# Altium project tajetaBaseV2.PrjPcb
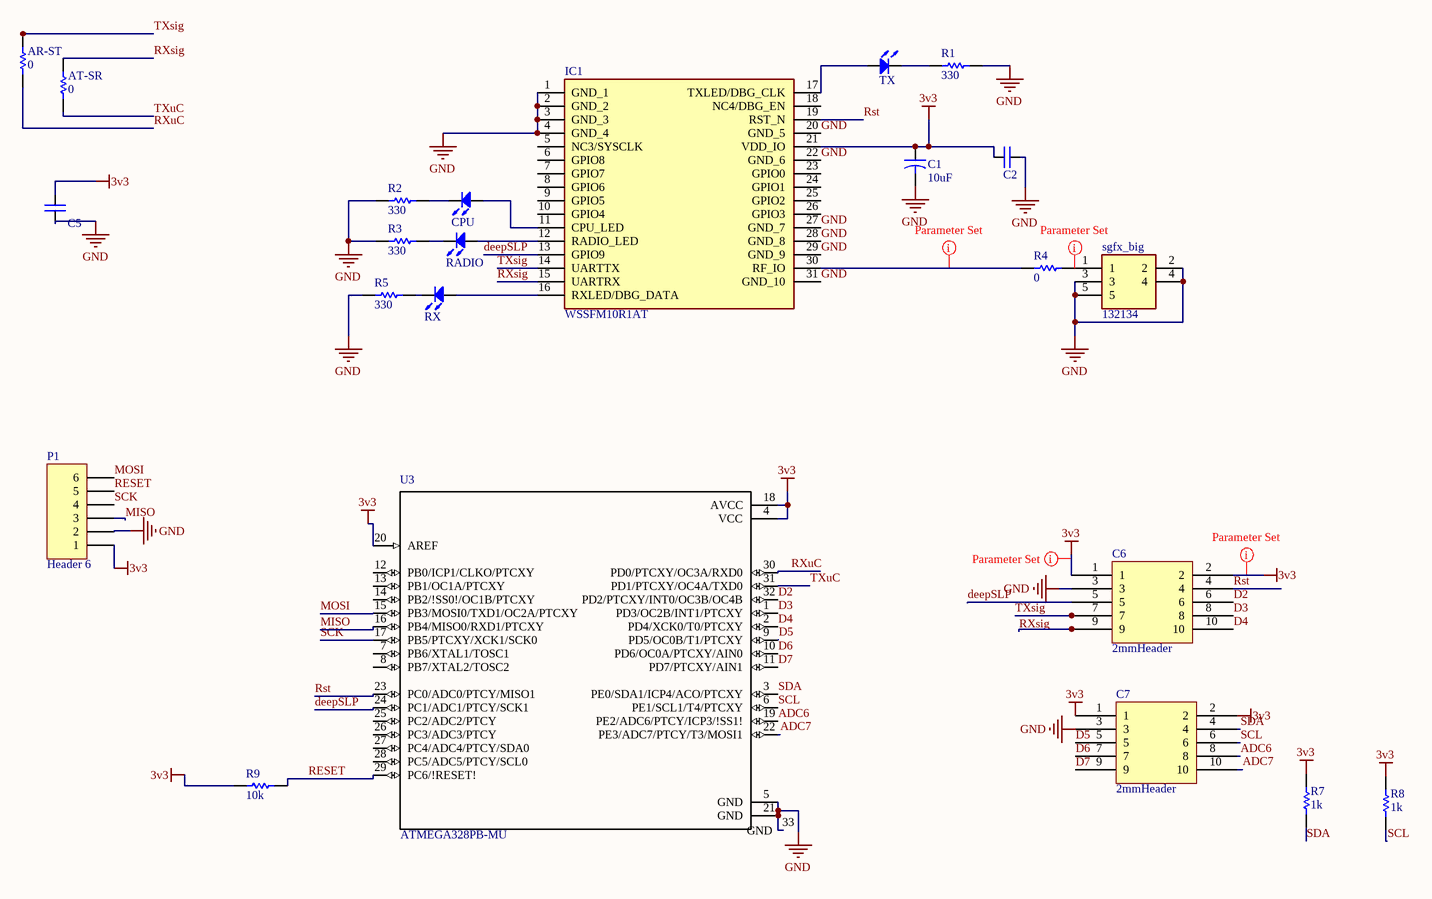
[diagram p0: mainV2.SchDoc]
1 sheet, 23 parts. Net scope: global (net labels, ports and power ports of the same name join across sheets).
Board file: mainPCBV2.PcbDoc

## Sheet mainV2.SchDoc
size A3; SheetNumber: 1; SheetTotal: 1

### Parts
AR-ST  value 0  [RES_SMD_0402]  (hidden comment: Res)
AT-SR  value 0  [RES_SMD_0402]  (hidden comment: Res)
C1  value 10uF  [Capacitor E SMT]  (hidden comment: Cap)
C2  CAP_SMT_0603  [SMT_CAP_0603]  (value not drawn)
C5  CAP_SMT_0603  [SMT_CAP_0603]  (value not drawn)
C6  2mmHeader  [2mmHeader5x2]
C7  2mmHeader  [2mmHeader5x2]
CPU  LED  [Led0805]  (value not drawn)
IC1  WSSFM10R1AT  [WSSFM10R1AT]
P1  Header 6  [HDR1X6]
R1  value 330  [RES_SMD_0402]  (hidden comment: Res)
R2  value 330  [RES_SMD_0402]  (hidden comment: Res)
R3  value 330  [RES_SMD_0402]  (hidden comment: Res)
R4  value 0  [RES_SMD_0402]  (hidden comment: Res)
R5  value 330  [RES_SMD_0402]  (hidden comment: Res)
R7  value 1k  [SMT_CAP_0603]  (hidden comment: Res)
R8  value 1k  [SMT_CAP_0603]  (hidden comment: Res)
R9  value 10k  [RES_SMD_0402]  (hidden comment: Res)
RADIO  LED  [Led0805]  (value not drawn)
RX  LED  [Led0805]  (value not drawn)
sgfx_big  132134  [132134]
TX  LED  [Led0805]  (value not drawn)
U3  ATMEGA328PB-MU  [ATMEGA328TQFP]

### Nets
3v3: C1.2 C2.1 C5.1 C6.1 C6.2 C7.1 C7.2 IC1.21(VDD_IO) P1.1 R7.1 R8.1 R9.1 U3.4(VCC) U3.18(AVCC) U3.20(AREF)
GND: C1.1 C2.2 C5.2 C6.3 C7.3 IC1.1(GND_1) IC1.2(GND_2) IC1.3(GND_3) IC1.4(GND_4) IC1.20(GND_5) IC1.22(GND_6) IC1.27(GND_7) IC1.28(GND_8) IC1.29(GND_9) IC1.31(GND_10) P1.2 R1.2 R2.1 R3.1 R5.1 sgfx_big.2 sgfx_big.3 sgfx_big.4 sgfx_big.5 U3.5(GND) U3.21(GND) U3.33(GND)
ADC6: C7.8 U3.19(PE2/ADC6/PTCY/ICP3/!SS1!)
ADC7: C7.10 U3.22(PE3/ADC7/PTCY/T3/MOSI1)
D2: C6.6 U3.32(PD2/PTCXY/INT0/OC3B/OC4B)
D3: C6.8 U3.1(PD3/OC2B/INT1/PTCXY)
D4: C6.10 U3.2(PD4/XCK0/T0/PTCXY)
D5: C7.5 U3.9(PD5/OC0B/T1/PTCXY)
D6: C7.7 U3.10(PD6/OC0A/PTCXY/AIN0)
D7: C7.9 U3.11(PD7/PTCXY/AIN1)
deepSLP: C6.5 IC1.13(GPIO9) U3.24(PC1/ADC1/PTCY/SCK1)
MISO: P1.3 U3.16(PB4/MISO0/RXD1/PTCXY)
MOSI: P1.6 U3.15(PB3/MOSI0/TXD1/OC2A/PTCXY)
RESET: P1.5 R9.2 U3.29(PC6/!RESET!)
Rst: C6.4 IC1.19(RST_N) U3.23(PC0/ADC0/PTCY/MISO1)
RXsig: AT-SR.1 C6.9 IC1.15(UARTRX)
RXuC: AR-ST.2 U3.30(PD0/PTCXY/OC3A/RXD0)
SCK: P1.4 U3.17(PB5/PTCXY/XCK1/SCK0)
SCL: C7.6 R8.2 U3.6(PE1/SCL1/T4/PTCXY)
SDA: C7.4 R7.2 U3.3(PE0/SDA1/ICP4/ACO/PTCXY)
TXsig: AR-ST.1 C6.7 IC1.14(UARTTX)
TXuC: AT-SR.2 U3.31(PD1/PTCXY/OC4A/TXD0)
NetCPU_1: CPU.1(A) IC1.11(CPU_LED)
NetCPU_2: CPU.2(K) R2.2
NetIC1_12: IC1.12(RADIO_LED) RADIO.1(A)
NetIC1_16: IC1.16(RXLED/DBG_DATA) RX.1(A)
NetIC1_17: IC1.17(TXLED/DBG_CLK) TX.1(A)
NetIC1_30: IC1.30(RF_IO) R4.1
NetR1_1: R1.1 TX.2(K)
NetR3_2: R3.2 RADIO.2(K)
NetR4_2: R4.2 sgfx_big.1
NetR5_2: R5.2 RX.2(K)

Not connected (* = marked no-connect by the designer): IC1 5(NC3/SYSCLK) 6(GPIO8) 7(GPIO7) 8(GPIO6) 9(GPIO5) 10(GPIO4) 18(NC4/DBG_EN) 23(GPIO0) 24(GPIO1) 25(GPIO2) 26(GPIO3); U3 7(PB6/XTAL1/TOSC1) 8(PB7/XTAL2/TOSC2) 12(PB0/ICP1/CLKO/PTCXY) 13(PB1/OC1A/PTCXY) 14(PB2/!SS0!/OC1B/PTCXY) 25(PC2/ADC2/PTCY) 26(PC3/ADC3/PTCY) 27(PC4/ADC4/PTCY/SDA0) 28(PC5/ADC5/PTCY/SCL0)

### Layout directives
net class Antena: NetIC1_30, NetR4_2
net class power: 3v3

### Library data of the parts
AR-ST AT-SR R7 R8 = RES_SMD: Resistor; Manufacturer: Generic Components; Class I: Passive; Published: 8-Jun-2000; Revision: July-2002: Re-released for DXP Platform.; Publisher: Altium Limited; Class II: Resistor
C1 = Cap E SMT: Capacitor Electrolitico; Manufacturer: Generic Components; Class I: Passive; Published: 23-Sep-2002; Publisher: Altium Limited; Class II: Capacitor
CPU RADIO RX TX = LED: Manufacturer: Generic Components; Class I: Optoelectronic; Published: 8-Jun-2000; Revision: July-2002: Re-released for DXP Platform.; Publisher: Altium Limited; Class II: LED
IC1 = WSSFM10R1AT: Integrated Circuit; Manufacturer_Name: Wisol; Datasheet Link: http://www.erikrasmussen.dk/wisol_wssfm10r1at.pdf; Height: 2mm; Manufacturer_Part_Number: WSSFM10R1AT
P1 = Header 6: Header, 6-Pin; LatestRevisionDate: 17-Jul-2002; LatestRevisionNote: Re-released for DXP Platform.; Publisher: Altium Limited
R1-R5 R9 = RES_SMT_1206: Resistor; Manufacturer: Generic Components; Class I: Passive; Published: 8-Jun-2000; Revision: July-2002: Re-released for DXP Platform.; Publisher: Altium Limited; Class II: Resistor
sgfx_big = 132134: Connector; Manufacturer_Name: Amphenol RF; Allied_Number: 70031837; Datasheet Link: https://www.amphenolrf.com/downloads/dl/file/id/2187/product/2843/132134_customer_drawing.pdf; Height: 9.53mm; Manufacturer_Part_Number: 132134; Mouser Part Number: 523-132134; Mouser Price/Stock: https://www.mouser.com/Search/Refine.aspx?Keyword=523-132134; Allied Price/Stock: https://www.alliedelec.com/amphenolrf-132134/70031837/
U3 = ATMEGA328PB-MU: AVR 32KBytes Flash, 1KBytes EEPROM, 2KBytes RAM, w - 20MHZ, QFN/MFL, IND TEMP, GREEN 5 V/ DFN/QFN _M_; MF: Microchip; Digi-Key_Part_Number: ATMEGA328PB-MU-ND; MP: ATMEGA328PB-MU; Package: VFQFN-32 Microchip; SnapEDA_Link: https://www.snapeda.com/parts/ATMEGA328PB-MU/Microchip/view-part/?ref=snap; Digi-Key_Purchase_URL: https://www.digikey.com/product-detail/en/microchip-technology/ATMEGA328PB-MU/ATMEGA328PB-MU-ND/5638814?utm_source=snapeda&utm_medium=aggregator&utm_campaign=symbol; Value: *